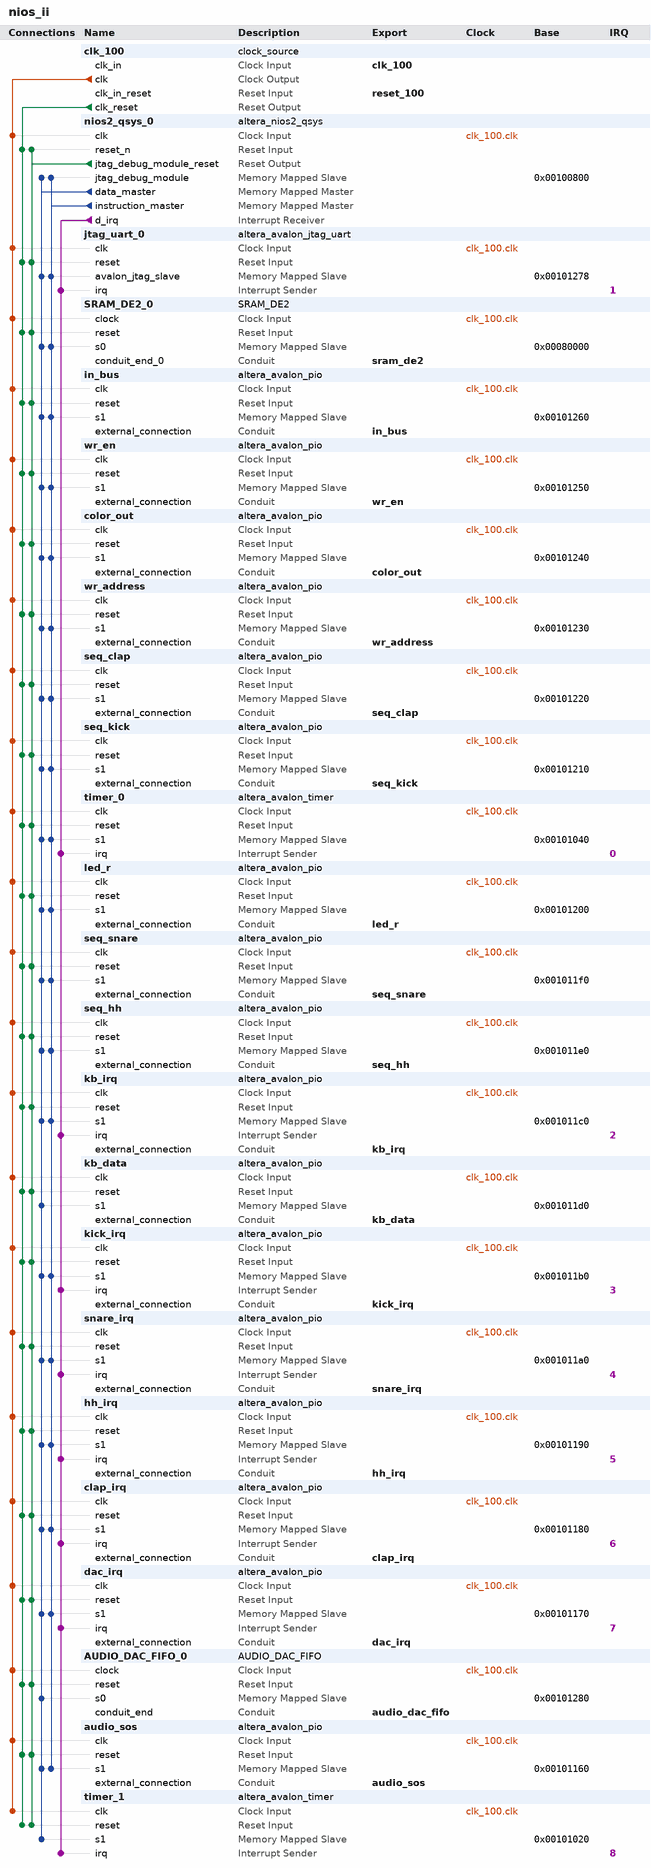
[diagram p0: system contents]
# Platform Designer (Qsys) system nios_ii, Cyclone II EP2C35F672C6
# Parameters at their usual value, and those the tool derives, are not listed.
package require -exact qsys 13.0.1
create_system nios_ii
set_project_property DEVICE_FAMILY {Cyclone II}
set_project_property DEVICE EP2C35F672C6

add_instance clk_100 clock_source 13.0
set_instance_parameter_value clk_100 clockFrequency 100000000

add_instance nios2_qsys_0 altera_nios2_qsys 13.0
set_instance_parameter_value nios2_qsys_0 resetSlave SRAM_DE2_0.s0
set_instance_parameter_value nios2_qsys_0 mmu_TLBMissExcSlave None
set_instance_parameter_value nios2_qsys_0 exceptionSlave SRAM_DE2_0.s0
set_instance_parameter_value nios2_qsys_0 breakSlave nios2_qsys_0.jtag_debug_module
set_instance_parameter_value nios2_qsys_0 impl Fast
set_instance_parameter_value nios2_qsys_0 icache_size 4096

add_instance jtag_uart_0 altera_avalon_jtag_uart 13.0.1
set_instance_parameter_value jtag_uart_0 simInteractiveOptions NO_INTERACTIVE_WINDOWS

add_instance SRAM_DE2_0 SRAM_DE2 1.0

add_instance in_bus altera_avalon_pio 13.0.1
set_instance_parameter_value in_bus direction Input
set_instance_parameter_value in_bus width 20

add_instance wr_en altera_avalon_pio 13.0.1
set_instance_parameter_value wr_en direction Output
set_instance_parameter_value wr_en width 1

add_instance color_out altera_avalon_pio 13.0.1
set_instance_parameter_value color_out direction Output
set_instance_parameter_value color_out width 2

add_instance wr_address altera_avalon_pio 13.0.1
set_instance_parameter_value wr_address direction Output
set_instance_parameter_value wr_address width 17

add_instance seq_clap altera_avalon_pio 13.0.1
set_instance_parameter_value seq_clap direction Output
set_instance_parameter_value seq_clap width 32

add_instance seq_kick altera_avalon_pio 13.0.1
set_instance_parameter_value seq_kick direction Output
set_instance_parameter_value seq_kick width 32

add_instance timer_0 altera_avalon_timer 13.0.1
set_instance_parameter_value timer_0 period 1
set_instance_parameter_value timer_0 periodUnits MSEC

add_instance led_r altera_avalon_pio 13.0.1
set_instance_parameter_value led_r direction Output
set_instance_parameter_value led_r width 18

add_instance seq_snare altera_avalon_pio 13.0.1
set_instance_parameter_value seq_snare direction Output
set_instance_parameter_value seq_snare width 32

add_instance seq_hh altera_avalon_pio 13.0.1
set_instance_parameter_value seq_hh direction Output
set_instance_parameter_value seq_hh width 32

add_instance kb_irq altera_avalon_pio 13.0.1
set_instance_parameter_value kb_irq captureEdge true
set_instance_parameter_value kb_irq direction Input
set_instance_parameter_value kb_irq generateIRQ true
set_instance_parameter_value kb_irq irqType EDGE
set_instance_parameter_value kb_irq width 1

add_instance kb_data altera_avalon_pio 13.0.1
set_instance_parameter_value kb_data direction Input
set_instance_parameter_value kb_data width 8

add_instance kick_irq altera_avalon_pio 13.0.1
set_instance_parameter_value kick_irq captureEdge true
set_instance_parameter_value kick_irq direction Input
set_instance_parameter_value kick_irq generateIRQ true
set_instance_parameter_value kick_irq irqType EDGE
set_instance_parameter_value kick_irq width 1

add_instance snare_irq altera_avalon_pio 13.0.1
set_instance_parameter_value snare_irq captureEdge true
set_instance_parameter_value snare_irq direction Input
set_instance_parameter_value snare_irq generateIRQ true
set_instance_parameter_value snare_irq irqType EDGE
set_instance_parameter_value snare_irq width 1

add_instance hh_irq altera_avalon_pio 13.0.1
set_instance_parameter_value hh_irq captureEdge true
set_instance_parameter_value hh_irq direction Input
set_instance_parameter_value hh_irq generateIRQ true
set_instance_parameter_value hh_irq irqType EDGE
set_instance_parameter_value hh_irq width 1

add_instance clap_irq altera_avalon_pio 13.0.1
set_instance_parameter_value clap_irq captureEdge true
set_instance_parameter_value clap_irq direction Input
set_instance_parameter_value clap_irq generateIRQ true
set_instance_parameter_value clap_irq irqType EDGE
set_instance_parameter_value clap_irq width 1

add_instance dac_irq altera_avalon_pio 13.0.1
set_instance_parameter_value dac_irq captureEdge true
set_instance_parameter_value dac_irq direction Input
set_instance_parameter_value dac_irq generateIRQ true
set_instance_parameter_value dac_irq irqType EDGE
set_instance_parameter_value dac_irq width 1

add_instance AUDIO_DAC_FIFO_0 AUDIO_DAC_FIFO 1.0
set_instance_parameter_value AUDIO_DAC_FIFO_0 REF_CLK 18432000
set_instance_parameter_value AUDIO_DAC_FIFO_0 SAMPLE_RATE 48000
set_instance_parameter_value AUDIO_DAC_FIFO_0 DATA_WIDTH 16
set_instance_parameter_value AUDIO_DAC_FIFO_0 CHANNEL_NUM 2

add_instance audio_sos altera_avalon_pio 13.0.1
set_instance_parameter_value audio_sos direction Output
set_instance_parameter_value audio_sos width 32

add_instance timer_1 altera_avalon_timer 13.0.1
set_instance_parameter_value timer_1 period 1
set_instance_parameter_value timer_1 periodUnits MSEC

# connections
add_connection clk_100.clk AUDIO_DAC_FIFO_0.clock clock
add_connection clk_100.clk audio_sos.clk clock
add_connection clk_100.clk clap_irq.clk clock
add_connection clk_100.clk color_out.clk clock
add_connection clk_100.clk dac_irq.clk clock
add_connection clk_100.clk hh_irq.clk clock
add_connection clk_100.clk in_bus.clk clock
add_connection clk_100.clk jtag_uart_0.clk clock
add_connection clk_100.clk kb_data.clk clock
add_connection clk_100.clk kb_irq.clk clock
add_connection clk_100.clk kick_irq.clk clock
add_connection clk_100.clk led_r.clk clock
add_connection clk_100.clk nios2_qsys_0.clk clock
add_connection clk_100.clk seq_clap.clk clock
add_connection clk_100.clk seq_hh.clk clock
add_connection clk_100.clk seq_kick.clk clock
add_connection clk_100.clk seq_snare.clk clock
add_connection clk_100.clk snare_irq.clk clock
add_connection clk_100.clk SRAM_DE2_0.clock clock
add_connection clk_100.clk timer_0.clk clock
add_connection clk_100.clk timer_1.clk clock
add_connection clk_100.clk wr_address.clk clock
add_connection clk_100.clk wr_en.clk clock
add_connection clk_100.clk_reset AUDIO_DAC_FIFO_0.reset reset
add_connection clk_100.clk_reset audio_sos.reset reset
add_connection clk_100.clk_reset clap_irq.reset reset
add_connection clk_100.clk_reset color_out.reset reset
add_connection clk_100.clk_reset dac_irq.reset reset
add_connection clk_100.clk_reset hh_irq.reset reset
add_connection clk_100.clk_reset in_bus.reset reset
add_connection clk_100.clk_reset jtag_uart_0.reset reset
add_connection clk_100.clk_reset kb_data.reset reset
add_connection clk_100.clk_reset kb_irq.reset reset
add_connection clk_100.clk_reset kick_irq.reset reset
add_connection clk_100.clk_reset led_r.reset reset
add_connection clk_100.clk_reset nios2_qsys_0.reset_n reset
add_connection clk_100.clk_reset seq_clap.reset reset
add_connection clk_100.clk_reset seq_hh.reset reset
add_connection clk_100.clk_reset seq_kick.reset reset
add_connection clk_100.clk_reset seq_snare.reset reset
add_connection clk_100.clk_reset snare_irq.reset reset
add_connection clk_100.clk_reset SRAM_DE2_0.reset reset
add_connection clk_100.clk_reset timer_0.reset reset
add_connection clk_100.clk_reset timer_1.reset reset
add_connection clk_100.clk_reset wr_address.reset reset
add_connection clk_100.clk_reset wr_en.reset reset
add_connection nios2_qsys_0.jtag_debug_module_reset AUDIO_DAC_FIFO_0.reset reset
add_connection nios2_qsys_0.jtag_debug_module_reset audio_sos.reset reset
add_connection nios2_qsys_0.jtag_debug_module_reset clap_irq.reset reset
add_connection nios2_qsys_0.jtag_debug_module_reset color_out.reset reset
add_connection nios2_qsys_0.jtag_debug_module_reset dac_irq.reset reset
add_connection nios2_qsys_0.jtag_debug_module_reset hh_irq.reset reset
add_connection nios2_qsys_0.jtag_debug_module_reset in_bus.reset reset
add_connection nios2_qsys_0.jtag_debug_module_reset jtag_uart_0.reset reset
add_connection nios2_qsys_0.jtag_debug_module_reset kb_data.reset reset
add_connection nios2_qsys_0.jtag_debug_module_reset kb_irq.reset reset
add_connection nios2_qsys_0.jtag_debug_module_reset kick_irq.reset reset
add_connection nios2_qsys_0.jtag_debug_module_reset led_r.reset reset
add_connection nios2_qsys_0.jtag_debug_module_reset nios2_qsys_0.reset_n reset
add_connection nios2_qsys_0.jtag_debug_module_reset seq_clap.reset reset
add_connection nios2_qsys_0.jtag_debug_module_reset seq_hh.reset reset
add_connection nios2_qsys_0.jtag_debug_module_reset seq_kick.reset reset
add_connection nios2_qsys_0.jtag_debug_module_reset seq_snare.reset reset
add_connection nios2_qsys_0.jtag_debug_module_reset snare_irq.reset reset
add_connection nios2_qsys_0.jtag_debug_module_reset SRAM_DE2_0.reset reset
add_connection nios2_qsys_0.jtag_debug_module_reset timer_0.reset reset
add_connection nios2_qsys_0.jtag_debug_module_reset timer_1.reset reset
add_connection nios2_qsys_0.jtag_debug_module_reset wr_address.reset reset
add_connection nios2_qsys_0.jtag_debug_module_reset wr_en.reset reset
add_connection nios2_qsys_0.data_master AUDIO_DAC_FIFO_0.s0 avalon
set_connection_parameter_value nios2_qsys_0.data_master/AUDIO_DAC_FIFO_0.s0 baseAddress 0x00101280
add_connection nios2_qsys_0.data_master audio_sos.s1 avalon
set_connection_parameter_value nios2_qsys_0.data_master/audio_sos.s1 baseAddress 0x00101160
add_connection nios2_qsys_0.data_master clap_irq.s1 avalon
set_connection_parameter_value nios2_qsys_0.data_master/clap_irq.s1 baseAddress 0x00101180
add_connection nios2_qsys_0.data_master color_out.s1 avalon
set_connection_parameter_value nios2_qsys_0.data_master/color_out.s1 baseAddress 0x00101240
add_connection nios2_qsys_0.data_master dac_irq.s1 avalon
set_connection_parameter_value nios2_qsys_0.data_master/dac_irq.s1 baseAddress 0x00101170
add_connection nios2_qsys_0.data_master hh_irq.s1 avalon
set_connection_parameter_value nios2_qsys_0.data_master/hh_irq.s1 baseAddress 0x00101190
add_connection nios2_qsys_0.data_master in_bus.s1 avalon
set_connection_parameter_value nios2_qsys_0.data_master/in_bus.s1 baseAddress 0x00101260
add_connection nios2_qsys_0.data_master jtag_uart_0.avalon_jtag_slave avalon
set_connection_parameter_value nios2_qsys_0.data_master/jtag_uart_0.avalon_jtag_slave baseAddress 0x00101278
add_connection nios2_qsys_0.data_master kb_data.s1 avalon
set_connection_parameter_value nios2_qsys_0.data_master/kb_data.s1 baseAddress 0x001011d0
add_connection nios2_qsys_0.data_master kb_irq.s1 avalon
set_connection_parameter_value nios2_qsys_0.data_master/kb_irq.s1 baseAddress 0x001011c0
add_connection nios2_qsys_0.data_master kick_irq.s1 avalon
set_connection_parameter_value nios2_qsys_0.data_master/kick_irq.s1 baseAddress 0x001011b0
add_connection nios2_qsys_0.data_master led_r.s1 avalon
set_connection_parameter_value nios2_qsys_0.data_master/led_r.s1 baseAddress 0x00101200
add_connection nios2_qsys_0.data_master nios2_qsys_0.jtag_debug_module avalon
set_connection_parameter_value nios2_qsys_0.data_master/nios2_qsys_0.jtag_debug_module baseAddress 0x00100800
add_connection nios2_qsys_0.data_master seq_clap.s1 avalon
set_connection_parameter_value nios2_qsys_0.data_master/seq_clap.s1 baseAddress 0x00101220
add_connection nios2_qsys_0.data_master seq_hh.s1 avalon
set_connection_parameter_value nios2_qsys_0.data_master/seq_hh.s1 baseAddress 0x001011e0
add_connection nios2_qsys_0.data_master seq_kick.s1 avalon
set_connection_parameter_value nios2_qsys_0.data_master/seq_kick.s1 baseAddress 0x00101210
add_connection nios2_qsys_0.data_master seq_snare.s1 avalon
set_connection_parameter_value nios2_qsys_0.data_master/seq_snare.s1 baseAddress 0x001011f0
add_connection nios2_qsys_0.data_master snare_irq.s1 avalon
set_connection_parameter_value nios2_qsys_0.data_master/snare_irq.s1 baseAddress 0x001011a0
add_connection nios2_qsys_0.data_master SRAM_DE2_0.s0 avalon
set_connection_parameter_value nios2_qsys_0.data_master/SRAM_DE2_0.s0 baseAddress 0x00080000
add_connection nios2_qsys_0.data_master timer_0.s1 avalon
set_connection_parameter_value nios2_qsys_0.data_master/timer_0.s1 baseAddress 0x00101040
add_connection nios2_qsys_0.data_master timer_1.s1 avalon
set_connection_parameter_value nios2_qsys_0.data_master/timer_1.s1 baseAddress 0x00101020
add_connection nios2_qsys_0.data_master wr_address.s1 avalon
set_connection_parameter_value nios2_qsys_0.data_master/wr_address.s1 baseAddress 0x00101230
add_connection nios2_qsys_0.data_master wr_en.s1 avalon
set_connection_parameter_value nios2_qsys_0.data_master/wr_en.s1 baseAddress 0x00101250
add_connection nios2_qsys_0.instruction_master audio_sos.s1 avalon
set_connection_parameter_value nios2_qsys_0.instruction_master/audio_sos.s1 baseAddress 0x00101160
add_connection nios2_qsys_0.instruction_master clap_irq.s1 avalon
set_connection_parameter_value nios2_qsys_0.instruction_master/clap_irq.s1 baseAddress 0x00101180
add_connection nios2_qsys_0.instruction_master color_out.s1 avalon
set_connection_parameter_value nios2_qsys_0.instruction_master/color_out.s1 baseAddress 0x00101240
add_connection nios2_qsys_0.instruction_master dac_irq.s1 avalon
set_connection_parameter_value nios2_qsys_0.instruction_master/dac_irq.s1 baseAddress 0x00101170
add_connection nios2_qsys_0.instruction_master hh_irq.s1 avalon
set_connection_parameter_value nios2_qsys_0.instruction_master/hh_irq.s1 baseAddress 0x00101190
add_connection nios2_qsys_0.instruction_master in_bus.s1 avalon
set_connection_parameter_value nios2_qsys_0.instruction_master/in_bus.s1 baseAddress 0x00101260
add_connection nios2_qsys_0.instruction_master jtag_uart_0.avalon_jtag_slave avalon
set_connection_parameter_value nios2_qsys_0.instruction_master/jtag_uart_0.avalon_jtag_slave baseAddress 0x00101278
add_connection nios2_qsys_0.instruction_master kb_irq.s1 avalon
set_connection_parameter_value nios2_qsys_0.instruction_master/kb_irq.s1 baseAddress 0x001011c0
add_connection nios2_qsys_0.instruction_master kick_irq.s1 avalon
set_connection_parameter_value nios2_qsys_0.instruction_master/kick_irq.s1 baseAddress 0x001011b0
add_connection nios2_qsys_0.instruction_master led_r.s1 avalon
set_connection_parameter_value nios2_qsys_0.instruction_master/led_r.s1 baseAddress 0x00101200
add_connection nios2_qsys_0.instruction_master nios2_qsys_0.jtag_debug_module avalon
set_connection_parameter_value nios2_qsys_0.instruction_master/nios2_qsys_0.jtag_debug_module baseAddress 0x00100800
add_connection nios2_qsys_0.instruction_master seq_clap.s1 avalon
set_connection_parameter_value nios2_qsys_0.instruction_master/seq_clap.s1 baseAddress 0x00101220
add_connection nios2_qsys_0.instruction_master seq_hh.s1 avalon
set_connection_parameter_value nios2_qsys_0.instruction_master/seq_hh.s1 baseAddress 0x001011e0
add_connection nios2_qsys_0.instruction_master seq_kick.s1 avalon
set_connection_parameter_value nios2_qsys_0.instruction_master/seq_kick.s1 baseAddress 0x00101210
add_connection nios2_qsys_0.instruction_master seq_snare.s1 avalon
set_connection_parameter_value nios2_qsys_0.instruction_master/seq_snare.s1 baseAddress 0x001011f0
add_connection nios2_qsys_0.instruction_master snare_irq.s1 avalon
set_connection_parameter_value nios2_qsys_0.instruction_master/snare_irq.s1 baseAddress 0x001011a0
add_connection nios2_qsys_0.instruction_master SRAM_DE2_0.s0 avalon
set_connection_parameter_value nios2_qsys_0.instruction_master/SRAM_DE2_0.s0 baseAddress 0x00080000
add_connection nios2_qsys_0.instruction_master timer_0.s1 avalon
set_connection_parameter_value nios2_qsys_0.instruction_master/timer_0.s1 baseAddress 0x00101040
add_connection nios2_qsys_0.instruction_master wr_address.s1 avalon
set_connection_parameter_value nios2_qsys_0.instruction_master/wr_address.s1 baseAddress 0x00101230
add_connection nios2_qsys_0.instruction_master wr_en.s1 avalon
set_connection_parameter_value nios2_qsys_0.instruction_master/wr_en.s1 baseAddress 0x00101250
add_connection nios2_qsys_0.d_irq clap_irq.irq interrupt
set_connection_parameter_value nios2_qsys_0.d_irq/clap_irq.irq irqNumber 6
add_connection nios2_qsys_0.d_irq dac_irq.irq interrupt
set_connection_parameter_value nios2_qsys_0.d_irq/dac_irq.irq irqNumber 7
add_connection nios2_qsys_0.d_irq hh_irq.irq interrupt
set_connection_parameter_value nios2_qsys_0.d_irq/hh_irq.irq irqNumber 5
add_connection nios2_qsys_0.d_irq jtag_uart_0.irq interrupt
set_connection_parameter_value nios2_qsys_0.d_irq/jtag_uart_0.irq irqNumber 1
add_connection nios2_qsys_0.d_irq kb_irq.irq interrupt
set_connection_parameter_value nios2_qsys_0.d_irq/kb_irq.irq irqNumber 2
add_connection nios2_qsys_0.d_irq kick_irq.irq interrupt
set_connection_parameter_value nios2_qsys_0.d_irq/kick_irq.irq irqNumber 3
add_connection nios2_qsys_0.d_irq snare_irq.irq interrupt
set_connection_parameter_value nios2_qsys_0.d_irq/snare_irq.irq irqNumber 4
add_connection nios2_qsys_0.d_irq timer_0.irq interrupt
set_connection_parameter_value nios2_qsys_0.d_irq/timer_0.irq irqNumber 0
add_connection nios2_qsys_0.d_irq timer_1.irq interrupt
set_connection_parameter_value nios2_qsys_0.d_irq/timer_1.irq irqNumber 8

# exported interfaces
add_interface sram_de2 conduit end
set_interface_property sram_de2 EXPORT_OF SRAM_DE2_0.conduit_end_0
add_interface color_out conduit end
set_interface_property color_out EXPORT_OF color_out.external_connection
add_interface wr_address conduit end
set_interface_property wr_address EXPORT_OF wr_address.external_connection
add_interface seq_clap conduit end
set_interface_property seq_clap EXPORT_OF seq_clap.external_connection
add_interface seq_kick conduit end
set_interface_property seq_kick EXPORT_OF seq_kick.external_connection
add_interface wr_en conduit end
set_interface_property wr_en EXPORT_OF wr_en.external_connection
add_interface reset_100 reset sink
set_interface_property reset_100 EXPORT_OF clk_100.clk_in_reset
add_interface in_bus conduit end
set_interface_property in_bus EXPORT_OF in_bus.external_connection
add_interface clk_100 clock sink
set_interface_property clk_100 EXPORT_OF clk_100.clk_in
add_interface led_r conduit end
set_interface_property led_r EXPORT_OF led_r.external_connection
add_interface seq_snare conduit end
set_interface_property seq_snare EXPORT_OF seq_snare.external_connection
add_interface seq_hh conduit end
set_interface_property seq_hh EXPORT_OF seq_hh.external_connection
add_interface kb_data conduit end
set_interface_property kb_data EXPORT_OF kb_data.external_connection
add_interface kb_irq conduit end
set_interface_property kb_irq EXPORT_OF kb_irq.external_connection
add_interface kick_irq conduit end
set_interface_property kick_irq EXPORT_OF kick_irq.external_connection
add_interface snare_irq conduit end
set_interface_property snare_irq EXPORT_OF snare_irq.external_connection
add_interface hh_irq conduit end
set_interface_property hh_irq EXPORT_OF hh_irq.external_connection
add_interface clap_irq conduit end
set_interface_property clap_irq EXPORT_OF clap_irq.external_connection
add_interface dac_irq conduit end
set_interface_property dac_irq EXPORT_OF dac_irq.external_connection
add_interface audio_dac_fifo conduit end
set_interface_property audio_dac_fifo EXPORT_OF AUDIO_DAC_FIFO_0.conduit_end
add_interface audio_sos conduit end
set_interface_property audio_sos EXPORT_OF audio_sos.external_connection

set_interconnect_requirement {$system} qsys_mm.clockCrossingAdapter HANDSHAKE
set_interconnect_requirement {$system} qsys_mm.maxAdditionalLatency 1

save_system nios_ii.qsys
